# Altium project 2021Capstone2.PrjPcb
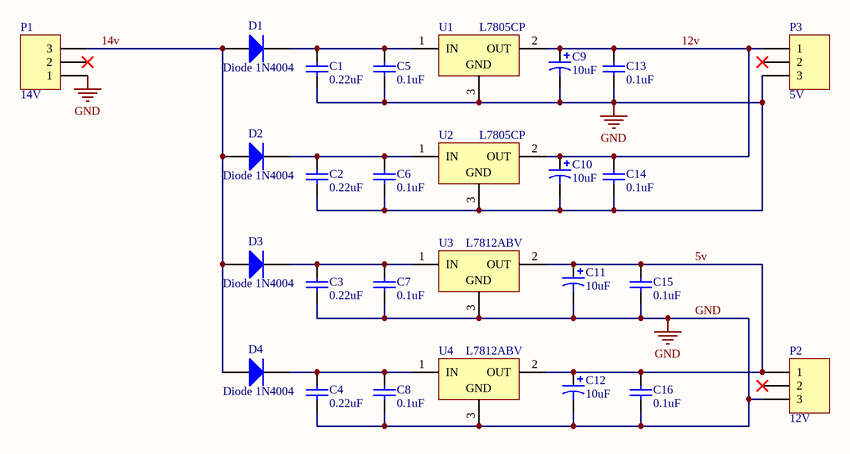
[diagram p0: Main_Circuit.SchDoc]
2 sheets, 30 parts. Net scope: flat (ports and power ports of the same name join across sheets).
Board file: Main.PcbDoc
Sheets:
  Main_Circuit.SchDoc
  Analog.SchDoc

## Sheet Main_Circuit.SchDoc
size A4

### Parts
C1  value 0.22uF  [RAD-0.3]  (hidden comment: Cap)
C2  value 0.22uF  [RAD-0.3]  (hidden comment: Cap)
C3  value 0.22uF  [RAD-0.3]  (hidden comment: Cap)
C4  value 0.22uF  [RAD-0.3]  (hidden comment: Cap)
C5  value 0.1uF  [RAD-0.3]  (hidden comment: Cap)
C6  value 0.1uF  [RAD-0.3]  (hidden comment: Cap)
C7  value 0.1uF  [RAD-0.3]  (hidden comment: Cap)
C8  value 0.1uF  [RAD-0.3]  (hidden comment: Cap)
C9  value 10uF  [RB7.6-15]  (hidden comment: Cap Pol1)
C10  value 10uF  [RB7.6-15]  (hidden comment: Cap Pol1)
C11  value 10uF  [RB7.6-15]  (hidden comment: Cap Pol1)
C12  value 10uF  [RB7.6-15]  (hidden comment: Cap Pol1)
C13  value 0.1uF  [RAD-0.3]  (hidden comment: Cap)
C14  value 0.1uF  [RAD-0.3]  (hidden comment: Cap)
C15  value 0.1uF  [RAD-0.3]  (hidden comment: Cap)
C16  value 0.1uF  [RAD-0.3]  (hidden comment: Cap)
D1  Diode 1N4004  [DO-41]
D2  Diode 1N4004  [DO-41]
D3  Diode 1N4004  [DO-41]
D4  Diode 1N4004  [DO-41]
P1  14V  [HDR1X3]
P2  12V  [HDR1X3]
P3  5V  [HDR1X3]
U1  L7805CP  [ISOWATT220AB]
U2  L7805CP  [ISOWATT220AB]
U3  L7812ABV  [TO220ABN]
U4  L7812ABV  [TO220ABN]

### Nets
GND: C1.1 C2.1 C3.1 C4.1 C5.1 C6.1 C7.1 C8.1 C9.2 C10.2 C11.2 C12.2 C13.1 C14.1 C15.1 C16.1 P1.1 P2.3 P3.3 U1.3(GND) U2.3(GND) U3.3(GND) U4.3(GND)
5v: C11.1 C12.1 C15.2 C16.2 P2.1 U3.2(OUT) U4.2(OUT)
12v: C9.1 C10.1 C13.2 C14.2 P3.1 U1.2(OUT) U2.2(OUT)
14v: D1.1(A) D2.1(A) D3.1(A) D4.1(A) P1.3
NetC1_2: C1.2 C5.2 D1.2(K) U1.1(IN)
NetC2_2: C2.2 C6.2 D2.2(K) U2.1(IN)
NetC3_2: C3.2 C7.2 D3.2(K) U3.1(IN)
NetC4_2: C4.2 C8.2 D4.2(K) U4.1(IN)

Not connected (* = marked no-connect by the designer): P1 2*; P2 2*; P3 2*

### Library data of the parts
C1-C8 C13-C16 = Cap: Capacitor; Published: 8-Jun-2000; LatestRevisionDate: 17-Jul-2002; LatestRevisionNote: Re-released for DXP Platform.; PackageReference: RAD-0.3; Publisher: Altium Limited; PackageDescription: Radial Cap, Thru-Hole; 2 Leads; 0.3 in Pin Spacing
C9-C12 = Cap Pol1: Polarized Capacitor (Radial); Published: 8-Jun-2000; LatestRevisionDate: 17-Jul-2002; LatestRevisionNote: Re-released for DXP Platform.; PackageReference: RB7.6-15; Publisher: Altium Limited; PackageDescription: Polarized Capacitor (Radial); 2 Leads
D1-D4 = Diode 1N4004: 1 Amp General Purpose Rectifier; Published: 8-Jun-2000; LatestRevisionDate: 17-Jul-2002; LatestRevisionNote: Re-released for DXP Platform.; DatasheetVersion: 1998; PackageVersion: Aug-1999; PackageReference: DO-41; Publisher: Altium Limited; PackageDescription: Diode, Axial; Body 5.2 x 2.7 mm (LxDia. max), Lead Dia. 0.86 mm (max); Code_JEDEC: DO-204-AL; ComponentLink1Description: Manufacturer Link; ComponentLink1URL: http://www.fairchildsemi.com/; ComponentLink2Description: Datasheet; ComponentLink2URL: http://www.fairchildsemi.com/ds/1N%2F1N4001.pdf
P1-P3 = Header 3: Header, 3-Pin; LatestRevisionDate: 17-Jul-2002; LatestRevisionNote: Re-released for DXP Platform.; Publisher: Altium Limited
U1 U2 = L7805CP: Positive Voltage Regulator; Note: Tab is connected to pin 3 (GND).; Published: 24-Aug-2001; LatestRevisionDate: 17-Jul-2002; LatestRevisionNote: Re-released for DXP Platform.; DatasheetVersion: Dec-1998; PackageVersion: Jul-1998; PackageReference: ISOWATT220AB; Publisher: Altium Limited; PackageDescription: TO, Thru-Hole, Vertical, Heatsink Mounted; 3 In-Line Leads; Pitch 2.54 mm; Pin sequence 1, 3, 2; ComponentLink1Description: Manufacturer Link; ComponentLink1URL: http://www.st.com/
U3 U4 = L7812ABV: Precision 1A Regulator; Published: 24-Aug-2001; LatestRevisionDate: 17-Jul-2002; LatestRevisionNote: Re-released for DXP Platform.; DatasheetVersion: Nov-1999; PackageVersion: Jun-1998; PackageReference: TO220ABN; Publisher: Altium Limited; PackageDescription: TO, Thru-Hole, Vertical, Heatsink Mounted; 3 In-Line Leads; Pitch 2.54 mm; Pin sequence 1, 3, 2; ComponentLink1Description: Manufacturer Link; ComponentLink1URL: http://www.st.com/; ComponentLink2Description: Datasheet; ComponentLink2URL: http://www.st.com/stonline/products/literature/ds/2144/l7805ab.pdf

## Sheet Analog.SchDoc
size A4
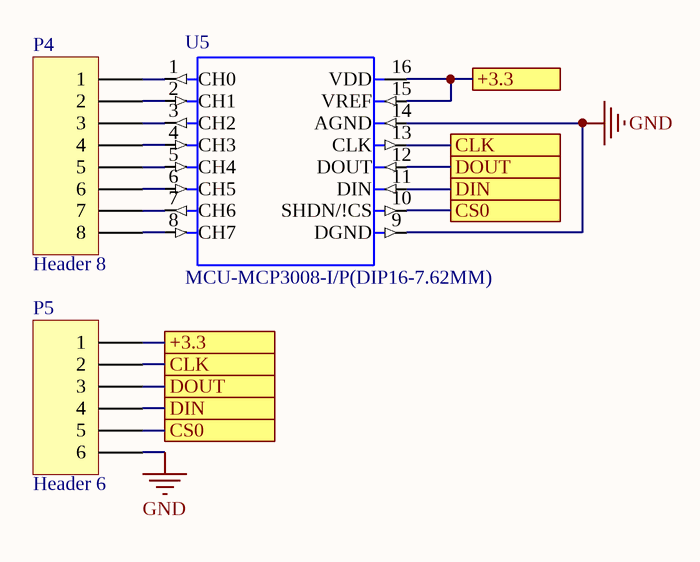
[diagram p1: Analog.SchDoc]

### Parts
P4  Header 8  [HDR1X8]
P5  Header 6  [HDR1X6]
U5  MCU-MCP3008-I/P(DIP16-7.62MM)  [DIP16-2.54-19.2X7.62MM]

### Ports
+3.3, CLK, CS0, DIN, DOUT

### Nets
GND: P5.6 U5.9(DGND) U5.14(AGND)
NetP4_1: P4.1 U5.1(CH0)
NetP4_2: P4.2 U5.2(CH1)
NetP4_3: P4.3 U5.3(CH2)
NetP4_4: P4.4 U5.4(CH3)
NetP4_5: P4.5 U5.5(CH4)
NetP4_6: P4.6 U5.6(CH5)
NetP4_7: P4.7 U5.7(CH6)
NetP4_8: P4.8 U5.8(CH7)
NetP5_1: P5.1 U5.15(VREF) U5.16(VDD) ; port +3.3
NetP5_2: P5.2 U5.13(CLK) ; port CLK
NetP5_3: P5.3 U5.12(DOUT) ; port DOUT
NetP5_4: P5.4 U5.11(DIN) ; port DIN
NetP5_5: P5.5 U5.10(SHDN/!CS) ; port CS0

### Library data of the parts
P4 = Header 8: Header, 8-Pin; LatestRevisionDate: 17-Jul-2002; LatestRevisionNote: Re-released for DXP Platform.; Publisher: Altium Limited
P5 = Header 6: Header, 6-Pin; LatestRevisionDate: 17-Jul-2002; LatestRevisionNote: Re-released for DXP Platform.; Publisher: Altium Limited
U5 = MCU-MCP3008-I/P(DIP16-7.62MM): 10 Bit Analog to Digital Converter 4, 8 Input 1 SAR 16-PDIP; MF: Microchip; Package: DIP-16 Microchip; Value: *; Availability: Unavailable; SnapEDA_Link: https://www.snapeda.com/parts/MCP3008-I/P/Microchip/view-part/43628/?ref=snap; Price: None; MP: MCP3008-I/P

## Nets that join several sheets
GND: Main_Circuit (23 pins), Analog (P5.6 U5.9 U5.14)